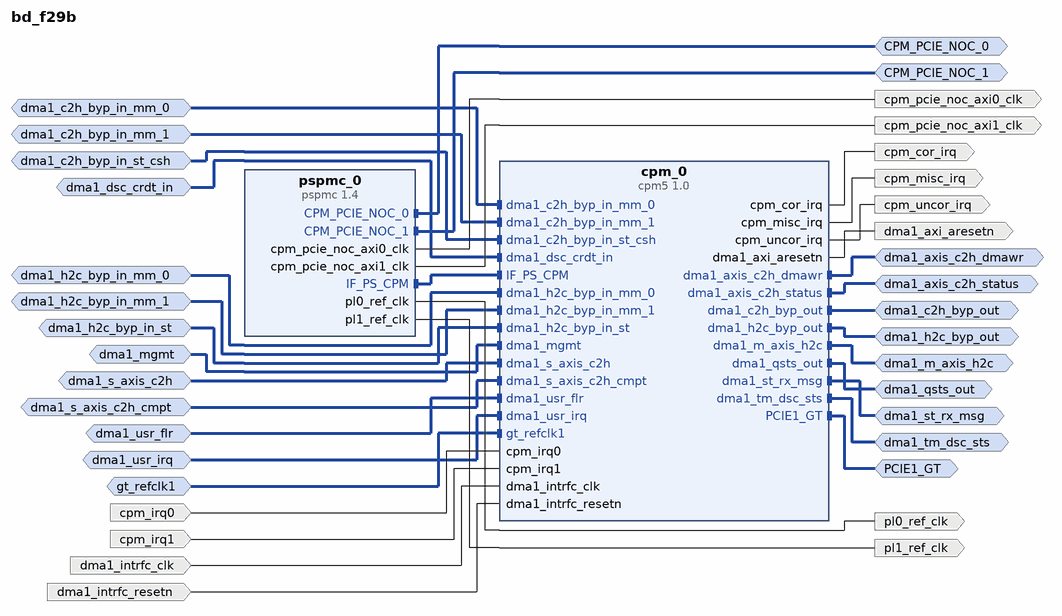
[diagram p0: block diagram of the top level]
# Vivado block design bd_f29b, xcvh1582-vsva3697-2MP-e-S, Vivado 2024.2
create_bd_design bd_f29b

create_bd_intf_port -mode Master -vlnv xilinx.com:interface:aximm_rtl:1.0 CPM_PCIE_NOC_0
set_property -dict {CONFIG.FREQ_HZ 1000000000 CONFIG.INDEX 0} [get_bd_intf_ports CPM_PCIE_NOC_0]
create_bd_intf_port -mode Master -vlnv xilinx.com:interface:aximm_rtl:1.0 CPM_PCIE_NOC_1
set_property -dict {CONFIG.FREQ_HZ 1000000000 CONFIG.INDEX 1} [get_bd_intf_ports CPM_PCIE_NOC_1]
create_bd_intf_port -mode Slave -vlnv xilinx.com:interface:cpm_dma_mgmt_rtl:1.0 dma1_mgmt
create_bd_intf_port -mode Master -vlnv xilinx.com:interface:axis_rtl:1.0 dma1_st_rx_msg
create_bd_intf_port -mode Slave -vlnv xilinx.com:interface:qdma_dsc_byp_rtl:1.0 dma1_c2h_byp_in_mm_0
create_bd_intf_port -mode Slave -vlnv xilinx.com:interface:qdma_dsc_byp_rtl:1.0 dma1_c2h_byp_in_mm_1
create_bd_intf_port -mode Slave -vlnv xilinx.com:interface:qdma_dsc_byp_rtl:1.0 dma1_c2h_byp_in_st_csh
create_bd_intf_port -mode Master -vlnv xilinx.com:interface:qdma_dsc_byp_rtl:1.0 dma1_c2h_byp_out
create_bd_intf_port -mode Slave -vlnv xilinx.com:interface:qdma_dsc_byp_rtl:1.0 dma1_h2c_byp_in_mm_0
create_bd_intf_port -mode Slave -vlnv xilinx.com:interface:qdma_dsc_byp_rtl:1.0 dma1_h2c_byp_in_mm_1
create_bd_intf_port -mode Slave -vlnv xilinx.com:interface:qdma_dsc_byp_rtl:1.0 dma1_h2c_byp_in_st
create_bd_intf_port -mode Master -vlnv xilinx.com:interface:qdma_dsc_byp_rtl:1.0 dma1_h2c_byp_out
create_bd_intf_port -mode Master -vlnv xilinx.com:display_eqdma:axis_c2h_dmawr_rtl:1.0 dma1_axis_c2h_dmawr
create_bd_intf_port -mode Slave -vlnv xilinx.com:display_eqdma:s_axis_c2h_rtl:1.0 dma1_s_axis_c2h
create_bd_intf_port -mode Slave -vlnv xilinx.com:display_eqdma:s_axis_c2h_cmpt_rtl:1.0 dma1_s_axis_c2h_cmpt
create_bd_intf_port -mode Master -vlnv xilinx.com:display_eqdma:m_axis_h2c_rtl:1.0 dma1_m_axis_h2c
create_bd_intf_port -mode Master -vlnv xilinx.com:interface:qdma_c2h_status_rtl:1.0 dma1_axis_c2h_status
create_bd_intf_port -mode Master -vlnv xilinx.com:interface:eqdma_qsts_rtl:1.0 dma1_qsts_out
create_bd_intf_port -mode Slave -vlnv xilinx.com:interface:qdma_dsc_crdt_in_rtl:1.0 dma1_dsc_crdt_in
create_bd_intf_port -mode Slave -vlnv xilinx.com:interface:qdma_usr_irq_rtl:1.0 dma1_usr_irq
create_bd_intf_port -mode Master -vlnv xilinx.com:interface:qdma_tm_dsc_sts_rtl:1.0 dma1_tm_dsc_sts
create_bd_intf_port -mode Slave -vlnv xilinx.com:interface:qdma_usr_flr_rtl:1.0 dma1_usr_flr
create_bd_intf_port -mode Master -vlnv xilinx.com:interface:gt_rtl:1.0 PCIE1_GT
create_bd_intf_port -mode Slave -vlnv xilinx.com:interface:diff_clock_rtl:1.0 gt_refclk1
set_property -dict {CONFIG.FREQ_HZ 100000000} [get_bd_intf_ports gt_refclk1]
create_bd_port -dir O -type clk pl0_ref_clk
set_property -dict {CONFIG.FREQ_HZ 249997498} [get_bd_ports pl0_ref_clk]
create_bd_port -dir O -type clk pl1_ref_clk
set_property -dict {CONFIG.FREQ_HZ 49999500} [get_bd_ports pl1_ref_clk]
create_bd_port -dir O -type clk cpm_pcie_noc_axi0_clk
set_property -dict {CONFIG.FREQ_HZ 1000000000} [get_bd_ports cpm_pcie_noc_axi0_clk]
create_bd_port -dir O -type clk cpm_pcie_noc_axi1_clk
set_property -dict {CONFIG.FREQ_HZ 1000000000} [get_bd_ports cpm_pcie_noc_axi1_clk]
create_bd_port -dir I -type clk dma1_intrfc_clk
set_property -dict {CONFIG.ASSOCIATED_RESET dma1_axi_aresetn} [get_bd_ports dma1_intrfc_clk]
create_bd_port -dir O -type intr cpm_misc_irq
create_bd_port -dir O -type intr cpm_cor_irq
create_bd_port -dir O -type intr cpm_uncor_irq
create_bd_port -dir I -type intr cpm_irq0
create_bd_port -dir I -type intr cpm_irq1
create_bd_port -dir O -type rst dma1_axi_aresetn
set_property -dict {CONFIG.POLARITY ACTIVE_LOW} [get_bd_ports dma1_axi_aresetn]
create_bd_port -dir I -type rst dma1_intrfc_resetn
set_property -dict {CONFIG.POLARITY ACTIVE_LOW} [get_bd_ports dma1_intrfc_resetn]

create_bd_cell -type ip -vlnv xilinx.com:ip:pspmc:1.4 pspmc_0
